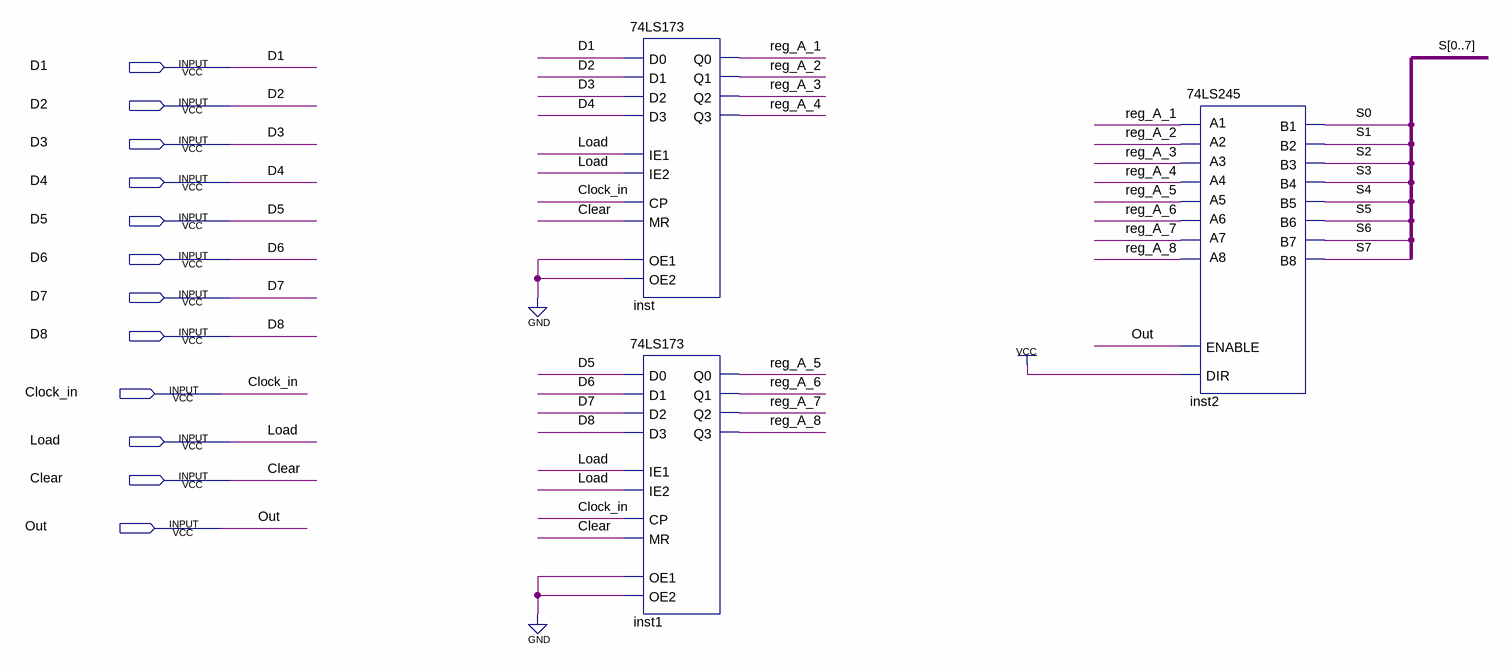
[diagram p0: schematic sheet]
// Quartus schematic Register_A.bdf as structural Verilog: 3 symbols, 12 pins
module Register_A (
  input  D1,
  input  D2,
  input  D3,
  input  D4,
  input  D5,
  input  D6,
  input  D7,
  input  D8,
  input  Clock_in,
  input  Load,
  input  Clear,
  input  Out
);

  wire reg_A_1, reg_A_2, reg_A_3, reg_A_4, reg_A_5, reg_A_6, reg_A_7, reg_A_8;
  wire [7:0] S;

  \74LS173  inst (
    .D0(D1), .D3(D4), .D1(D2), .D2(D3), .IE1(Load), .IE2(Load), .CP(Clock_in), .MR(Clear), .OE1(1'b0),
    .OE2(1'b0), .Q0(reg_A_1), .Q1(reg_A_2), .Q2(reg_A_3), .Q3(reg_A_4));
  \74LS173  inst1 (
    .D0(D5), .D3(D8), .D1(D6), .D2(D7), .IE1(Load), .IE2(Load), .CP(Clock_in), .MR(Clear), .OE1(1'b0),
    .OE2(1'b0), .Q0(reg_A_5), .Q1(reg_A_6), .Q2(reg_A_7), .Q3(reg_A_8));
  \74LS245  inst2 (
    .ENABLE(Out), .DIR(1'b1), .B1(S[0]), .B2(S[1]), .B3(S[2]), .B4(S[3]), .B5(S[4]), .B6(S[5]), .B7(S[6]),
    .B8(S[7]), .A1(reg_A_1), .A2(reg_A_2), .A3(reg_A_3), .A4(reg_A_4), .A5(reg_A_5), .A6(reg_A_6),
    .A7(reg_A_7), .A8(reg_A_8));
endmodule
